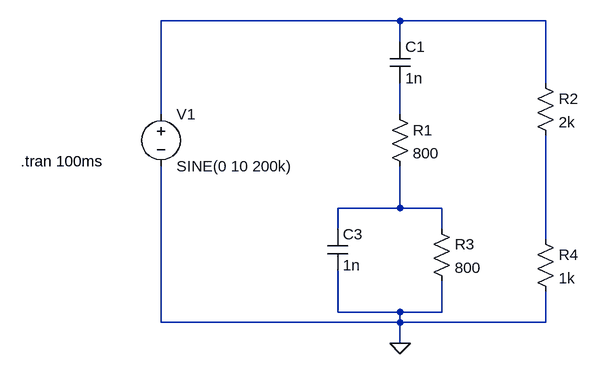
[diagram p0: schematic Simulacion.asc]
Simulacion.asc, the LTspice schematic file:
Version 4
SHEET 1 880 680
WIRE 144 -48 -224 -48
WIRE 368 -48 144 -48
WIRE 144 -16 144 -48
WIRE 368 48 368 -48
WIRE -224 96 -224 -48
WIRE 144 96 144 48
WIRE 144 240 144 176
WIRE 144 240 48 240
WIRE 208 240 144 240
WIRE 48 272 48 240
WIRE 208 272 208 240
WIRE 368 288 368 128
WIRE 48 400 48 336
WIRE 144 400 48 400
WIRE 208 400 208 352
WIRE 208 400 144 400
WIRE -224 416 -224 176
WIRE 144 416 144 400
WIRE 144 416 -224 416
WIRE 368 416 368 368
WIRE 368 416 144 416
WIRE 144 448 144 416
FLAG 144 448 0
SYMBOL res 128 80 R0
SYMATTR InstName R1
SYMATTR Value 800
SYMBOL res 352 32 R0
SYMATTR InstName R2
SYMATTR Value 2k
SYMBOL res 352 272 R0
SYMATTR InstName R4
SYMATTR Value 1k
SYMBOL res 192 256 R0
SYMATTR InstName R3
SYMATTR Value 800
SYMBOL cap 32 272 R0
SYMATTR InstName C3
SYMATTR Value 1n
SYMBOL cap 128 -16 R0
SYMATTR InstName C1
SYMATTR Value 1n
SYMBOL voltage -224 80 R0
WINDOW 123 0 0 Left 0
WINDOW 39 0 0 Left 0
SYMATTR InstName V1
SYMATTR Value SINE(0 10 200k)
TEXT -440 168 Left 2 !.tran 100ms

The netlist it stands for:
* Simulacion.asc
R1 N002 N003 800
R2 N001 N004 2k
R4 N004 0 1k
R3 N003 0 800
C3 N003 0 1n
C1 N001 N002 1n
V1 N001 0 SINE(0 10 200k)
.tran 100ms
.backanno
.end